# Altium schematic sheet SWD.SchDoc: SWD Connector
size A4; DrawnBy: Miłosz Werner; Organization: Wroclaw University of Science and Technology; Revision: 1.0; SheetNumber: 9; SheetTotal: 9